# EAGLE design sensor_board_v1.3 (EAGLE 7.7.0)
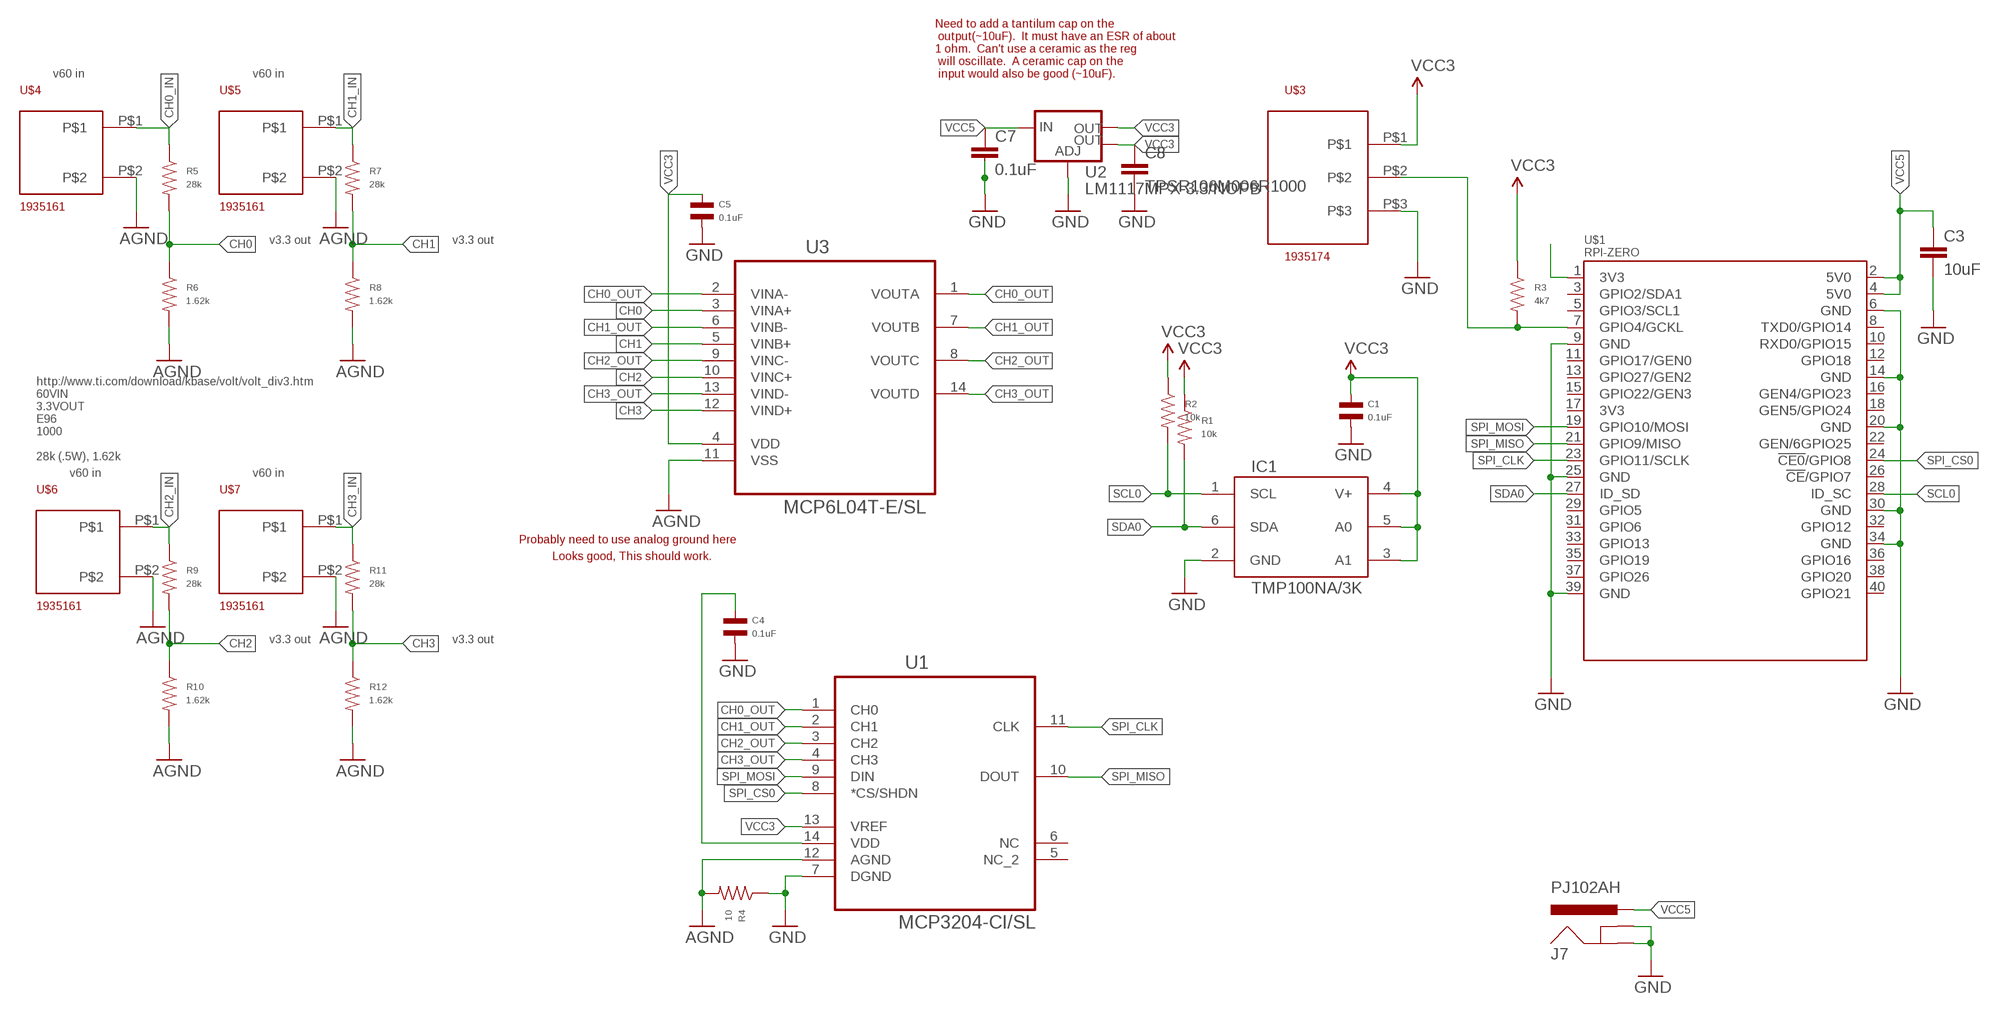
[diagram p0: schematic, sheet 1]

## Parts
C1  0.1uF  CAPACITOR_NP_0603  [C0603]
C3  10uF  CAP0603-CAP  [0603-CAP]
C4  0.1uF  CAPACITOR_NP_0603  [C0603]
C5  0.1uF  CAPACITOR_NP_0603  [C0603]
C7  0.1uF  CAP0603-CAP  [0603-CAP]
C8  TPSR106M006R1000  CAP0805  [0805]
IC1  TMP100NA/3K  TMP100  [TI-DBV]
J7  PJ102AH  POWER_JACK  [PJ-102AH]
R1  10k  RESISTOR_0603  [R0603]
R2  10k  RESISTOR_0603  [R0603]
R3  4k7  RESISTOR_0603  [R0603]
R4  10  RESISTOR_1206  [R1206]
R5  28k  RESISTOR_1206  [R1206]
R6  1.62k  RESISTOR_1206  [R1206]
R7  28k  RESISTOR_1206  [R1206]
R8  1.62k  RESISTOR_1206  [R1206]
R9  28k  RESISTOR_1206  [R1206]
R10  1.62k  RESISTOR_1206  [R1206]
R11  28k  RESISTOR_1206  [R1206]
R12  1.62k  RESISTOR_1206  [R1206]
U1  MCP3204-CI/SL  [SOIC127P600X175-14N]
U2  LM1117MPX-3.3/NOPB  V_REG_LM1117SOT223  [SOT223]
U3  MCP6L04T-E/SL  [SOIC127P600X175-14N]
U$1  RPI-ZERO  [RASPBERRYPI_BASTELSTUBE_V13_RASPI_BOARD_B+_FULL]
U$3  1935174  [1935174]
U$4  1935161  [1935161]
U$5  1935161  [1935161]
U$6  1935161  [1935161]
U$7  1935161  [1935161]

## Nets
1WIRE_D: R3.P$2 U$1.7(GPIO4/GCKL) U$3.P$2
AGND: R4.P$2 R6.P$2 R8.P$2 R10.P$2 R12.P$2 U1.12(AGND) U3.11(VSS) U$4.P$2 U$5.P$2 U$6.P$2 U$7.P$2
CH0: R5.P$2 R6.P$1 U3.3(VINA+)
CH0_IN: R5.P$1 U$4.P$1
CH0_OUT: U1.1(CH0) U3.1(VOUTA) U3.2(VINA-)
CH1: R7.P$2 R8.P$1 U3.5(VINB+)
CH1_IN: R7.P$1 U$5.P$1
CH1_OUT: U1.2(CH1) U3.6(VINB-) U3.7(VOUTB)
CH2: R9.P$2 R10.P$1 U3.10(VINC+)
CH2_IN: R9.P$1 U$6.P$1
CH2_OUT: U1.3(CH2) U3.8(VOUTC) U3.9(VINC-)
CH3: R11.P$2 R12.P$1 U3.12(VIND+)
CH3_IN: R11.P$1 U$7.P$1
CH3_OUT: U1.4(CH3) U3.13(VIND-) U3.14(VOUTD)
GND: C1.P$2 C3.2 C4.P$2 C5.P$2 C7.2 C8.2 IC1.2(GND) J7.2(GND) J7.3(GNDBREAK) R4.P$1 U1.7(DGND) U2.1(ADJ) U$1.6(GND) U$1.9(GND) U$1.14(GND) U$1.20(GND) U$1.25(GND) U$1.30(GND) U$1.34(GND) U$1.39(GND) U$3.P$3
SCL0: IC1.1(SCL) R2.P$2 U$1.28(ID_SC)
SDA0: IC1.6(SDA) R1.P$2 U$1.27(ID_SD)
SPI_CLK: U1.11(CLK) U$1.23(GPIO11/SCLK)
SPI_CS0: U1.8(*CS/SHDN) U$1.24(!CE0!/GPIO8)
SPI_MISO: U1.10(DOUT) U$1.21(GPIO9/MISO)
SPI_MOSI: U1.9(DIN) U$1.19(GPIO10/MOSI)
VCC3: C1.P$1 C4.P$1 C5.P$1 C8.1 IC1.3(A1) IC1.4(V+) IC1.5(A0) R1.P$1 R2.P$1 R3.P$1 U1.13(VREF) U1.14(VDD) U2.2(OUT) U2.4(OUT) U3.4(VDD) U$1.1(3V3) U$3.P$1
VCC5: C3.1 C7.1 J7.1(PWR) U2.3(IN) U$1.2(5V0) U$1.4(5V0)
Unconnected: U1.5(NC_2) U1.6(NC) U$1.3(GPIO2/SDA1) U$1.5(GPIO3/SCL1) U$1.8(TXD0/GPIO14) U$1.10(RXD0/GPIO15) U$1.11(GPIO17/GEN0) U$1.12(GPIO18) U$1.13(GPIO27/GEN2) U$1.15(GPIO22/GEN3) U$1.16(GEN4/GPIO23) U$1.17(3V3) U$1.18(GEN5/GPIO24) U$1.22(GEN/6GPIO25) U$1.26(!CE!/GPIO7) U$1.29(GPIO5) U$1.31(GPIO6) U$1.32(GPIO12) U$1.33(GPIO13) U$1.35(GPIO19) U$1.36(GPIO16) U$1.37(GPIO26) U$1.38(GPIO20) U$1.40(GPIO21)

## Notes on the sheet
- v60 in | v60 in
- Need to add a tantilum cap on the
   output(~10uF).  It must have an ESR of about 
  1 ohm.  Can't use a ceramic as the reg
   will oscillate.  A ceramic cap on the
   input would also be good (~10uF).
- v3.3 out | v3.3 out
- http://www.ti.com/download/kbase/volt/volt_div3.htm
  60VIN
  3.3VOUT
  E96
  1000
  
  28k (.5W), 1.62k
- v60 in | v60 in
- Probably need to use analog ground here
- Looks good, This should work.
- v3.3 out | v3.3 out

## Library data of the parts
C1 C4 C5 = MF_Passives:CAPACITOR_NP: Library: MF_Passives Description: Device for Non-Polarized Capacitors. Manufacture part number (MPN) can be added via Attributes. Check https://factory.macrofab.com/parts for the house parts list.; POPULATE: 1
C3 C7 C8 = General:CAP: Capacitor Standard 0603 ceramic capacitor, and 0.1" leaded capacitor.
IC1 = Dual_SFP:TMP100
J7 = Dual_SFP:POWER_JACK
R1-R4 R6 R8 R10 R12 = MF_Passives:RESISTOR: Library: MF_Passives Description: Device for Resistors. Manufacture part number (MPN), Voltage, Tolerance, and Wattage Rating can be added via Attributes. Check https://factory.macrofab.com/parts for the house parts list.; POPULATE: 1
R5 R7 R9 R11 = MF_Passives:RESISTOR: Library: MF_Passives Description: Device for Resistors. Manufacture part number (MPN), Voltage, Tolerance, and Wattage Rating can be added via Attributes. Check https://factory.macrofab.com/parts for the house parts list.; MPN: RNCP1206FTD28K0; POPULATE: 1
U1 = Microchip_By_element14_Batch_1:MCP3204-CI/SL: IC ADC 12BIT 2.7V 4CH SPI; MPN: MCP3204-CI/SL; OC_FARNELL: 1196795; OC_NEWARK: 26M1276; PACKAGE: 14 - SOIC; SUPPLIER: Microchip
U2 = SparkFun-IC-Power:V_REG_LM1117: Voltage Regulator LM1117 Standard adjustable voltage regulator but in SMD form. Spark Fun Electronics SKU : COM-00595; PROD_ID: LM1117MPX-3.3/NOPB
U3 = Microchip_By_element14_Batch_1:MCP6L04T-E/SL: IC, OP-AMP, 1MHZ, 0.6V/µs; MPN: MCP6L04T-E/SL; OC_FARNELL: 1715883; OC_NEWARK: 06R3493; PACKAGE: SOIC - 14; SUPPLIER: Microchip
U$1 = RPI-Zero:RPI-ZERO
U$3 = WhiteBoxOptical:1935174
U$4-U$7 = WhiteBoxOptical:1935161

## Board
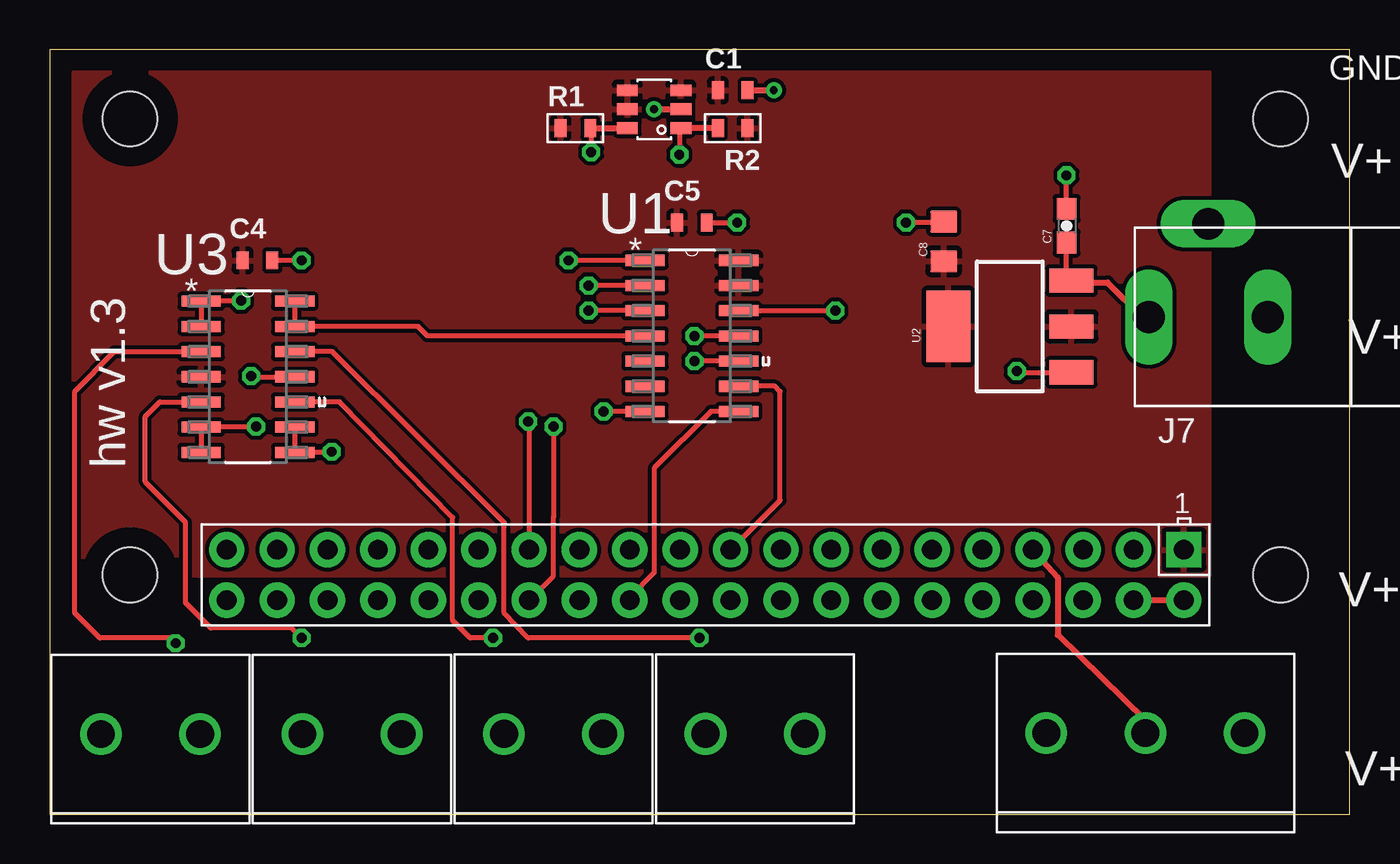
[diagram p1: board, top side]
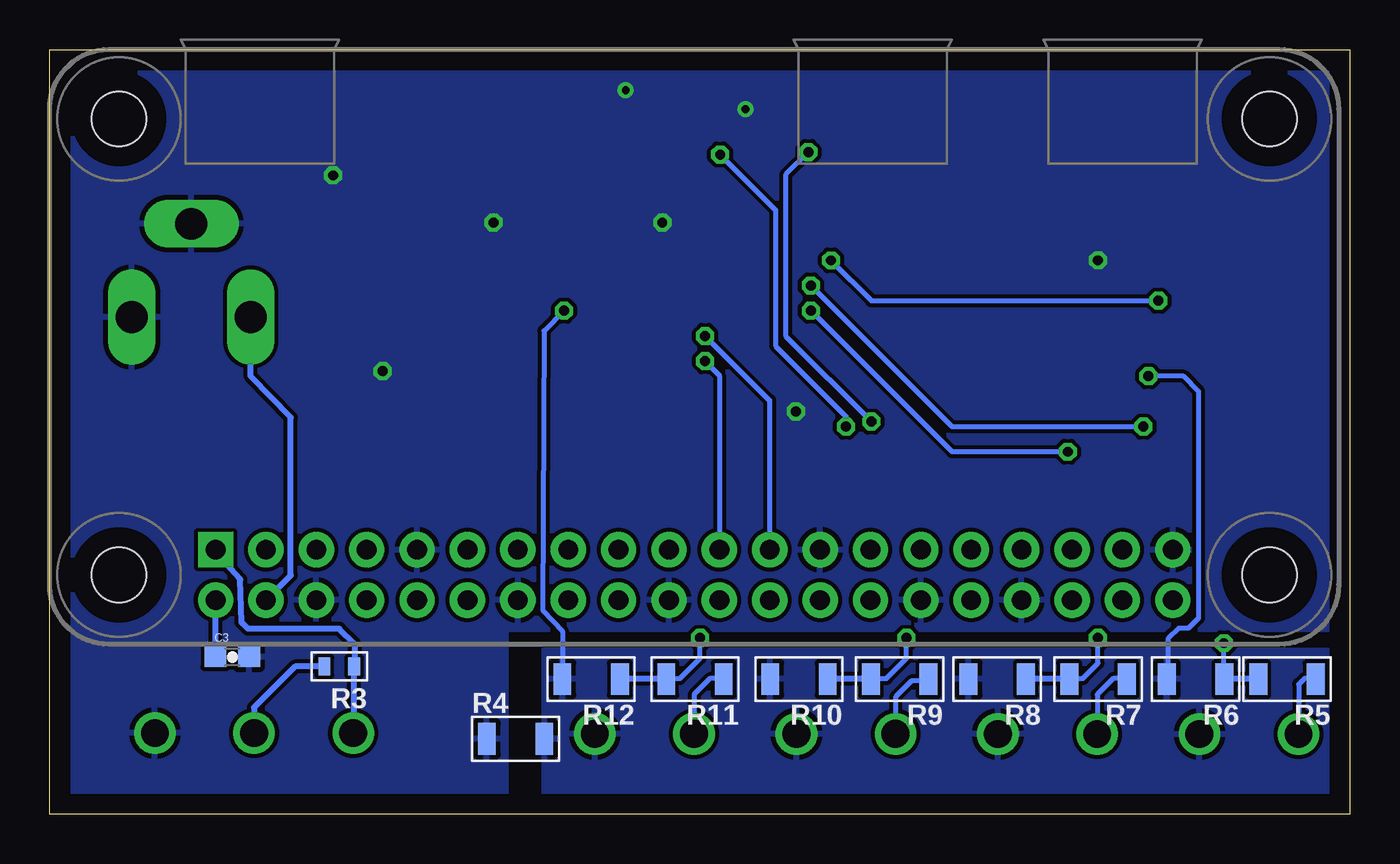
[diagram p2: board, bottom side, seen from below]

Size 65.56 x 38.57 mm. Coordinates in mm from the lower left corner, seen from the top.
Outline: 0,0 65.56,0 65.56,38.57 0,38.57 0,0
Copper layers (1*16): Top 0.035mm / dielectric 1.5mm / Bottom 0.035mm
Design rules "default": minimum track width 10mil, minimum drill 24mil, track to track 8mil, track to pad 8mil, pad to pad 8mil, via to via 8mil, smd to smd 8mil, copper to edge 40mil, drill to drill 8mil, minimum pad ring 10mil, minimum via ring 8mil, stop-mask expansion 4mil, vias tented up to drill 0mil, thermal gap 10mil

### Footprints (pad centres in the part's own frame; a part is rotated, then mirrored left to right if it is on the bottom)
C0603 = smd 0.6 x 0.9: P$1 -0.75,0; P$2 0.75,0
0603-CAP = smd 1 x 1.1: 1 0,0.85; 2 0,-0.85
0805 = smd 1.35 x 1.1: 1 0,1; 2 0,-1
TI-DBV = smd 0.6 x 1.05: 1 -0.95,-1.35; 2 0,-1.35; 3 0.95,-1.35; 4 0.95,1.35; 5 0,1.35; 6 -0.95,1.35
PJ-102AH = drill 1.6 long: 1 0,-3; 2 0,3; 3 -4.7,0
R0603 = smd 0.6 x 0.9: P$1 -0.75,0; P$2 0.75,0
R1206 = smd 0.9 x 1.6: P$1 -1.45,0; P$2 1.45,0
SOIC127P600X175-14N = smd 1.981 x 0.559: 1 -2.362,3.81; 2 -2.362,2.54; 3 -2.362,1.27; 4 -2.362,0; 5 -2.362,-1.27; 6 -2.362,-2.54; 7 -2.362,-3.81; 8 2.362,-3.81; 9 2.362,-2.54; 10 2.362,-1.27; 11 2.362,0; 12 2.362,1.27; 13 2.362,2.54; 14 2.362,3.81
SOT223 = smd 1.219 x 2.235: 1 -2.311,-3.099; 2 0,-3.099; 3 2.311,-3.099 | smd 3.6 x 2.2: 4 0,3.099
RASPBERRYPI_BASTELSTUBE_V13_RASPI_BOARD_B+_FULL = drill 1 pad 1.778 square: 1 8.37,25.23 | drill 1 pad 1.778: 2 8.37,27.77; 3 10.91,25.23; 4 10.91,27.77; 5 13.45,25.23; 6 13.45,27.77; 7 15.99,25.23; 8 15.99,27.77; 9 18.53,25.23; 10 18.53,27.77; 11 21.07,25.23; 12 21.07,27.77; 13 23.61,25.23; 14 23.61,27.77; 15 26.15,25.23; 16 26.15,27.77; 17 28.69,25.23; 18 28.69,27.77; 19 31.23,25.23; 20 31.23,27.77; 21 33.77,25.23; 22 33.77,27.77; 23 36.31,25.23; 24 36.31,27.77; 25 38.85,25.23; 26 38.85,27.77; 27 41.39,25.23; 28 41.39,27.77; 29 43.93,25.23; 30 43.93,27.77; 31 46.47,25.23; 32 46.47,27.77; 33 49.01,25.23; 34 49.01,27.77; 35 51.55,25.23; 36 51.55,27.77; 37 54.09,25.23; 38 54.09,27.77; 39 56.63,25.23; 40 56.63,27.77 | hole 2.75: 3.5,3.5; 3.5,26.5; 61.5,3.5; 61.5,26.5
1935174 = drill 1.4: P$1 -5,0; P$2 0,0; P$3 5,0
1935161 = drill 1.4: P$1 -2.5,0; P$2 2.5,0

### Placement (x,y rotation side)
C1  34.45,36.51 0 top
C3  56.36,7.94 90 bottom
C4  10.48,27.94 0 top
C5  32.38,29.84 0 top
C7  51.28,29.69 180 top
C8  45.09,28.89 180 top
IC1  30.48,35.56 90 top
J7  58.42,25.08 270 top
R1  26.51,34.61 0 top
R2  34.45,34.61 180 top
R3  50.96,7.46 180 bottom
R4  42.07,3.81 0 bottom
R5  3.17,6.83 180 bottom
R6  7.78,6.83 180 bottom
R7  12.7,6.83 180 bottom
R8  17.78,6.83 180 bottom
R9  22.7,6.83 180 bottom
R10  27.78,6.83 180 bottom
R11  33.02,6.83 180 bottom
R12  38.26,6.83 180 bottom
U1  32.38,24.13 0 top
U2  48.42,24.61 90 top
U3  10,22.07 0 top
U$1  65.56,38.58 180 top
U$3  55.25,4.1 0 top
U$4  5.09,4.05 0 top
U$5  15.25,4.05 0 top
U$6  25.41,4.06 0 top
U$7  35.57,4.06 0 top

### Tracks (layer width: path | path; a pad name or v marks a point on that pad's centre or on a via)
1WIRE_D
  Top 0.305: U$1.7 50.83,11.96 50.83,9.05 55.25,4.75 U$3.P$2
  Bottom 0.305: R3.P$2 53.18,7.46 55.25,5.39 U$3.P$2
AGND  (via drill 0.5)
  Top 0.254: U1.12 v39.62,25.4 | v10.16,22.1 10.19,22.07 U3.11
  Bottom 0.254: v39.62,25.4 40.64,24.38 40.7,10.29 39.71,9.23 R12.P$2 | R6.P$2 9.14,6.91 9.14,8.89 8.64,9.4 8.13,9.4 7.62,9.91 7.62,21.34 8.38,22.1 v10.16,22.1
  pour Bottom: 0.16,8.26 40.64,8.26 40.64,-0.16 0.16,-0.16
CH0  (via drill 0.5)
  Top 0.254: v6.35,8.64 6.1,8.89 2.54,8.89 1.27,10.16 1.27,21.34 3.27,23.34 U3.3
  Bottom 0.254: R6.P$1 6.35,6.85 v6.35,8.64
  Bottom 0.305: R5.P$2 R6.P$1
CH0_IN
  Bottom 0.254: R5.P$1 1.82,6.73 1.95,6.86 2.29,6.86 2.59,6.56 U$4.P$1
CH0_OUT  (via drill 0.5)
  Top 0.254: U1.1 v26.16,27.94 | v9.65,25.91 9.62,25.88 U3.1 U3.2
  Bottom 0.254: v26.16,27.94 24.13,25.91 v9.65,25.91
CH1  (via drill 0.5)
  Top 0.254: v12.7,8.89 12.19,9.4 8.13,9.4 6.86,10.67 6.86,14.73 4.83,16.76 4.83,20.07 5.56,20.8 U3.5
  Bottom 0.254: R7.P$2 14.12,6.86 13.46,6.86 12.7,7.62 v12.7,8.89
  Bottom 0.305: R7.P$2 R8.P$1
CH1_IN
  Bottom 0.254: R7.P$1 11.28,6.86 11.94,6.86 12.75,6.05 U$5.P$1
CH1_OUT  (via drill 0.5)
  Top 0.254: U1.2 v27.18,26.67 | U3.7 U3.6 7.67,19.56 v10.41,19.56
  Bottom 0.254: v27.18,26.67 20.07,19.56 v10.41,19.56
CH2  (via drill 0.5)
  Top 0.254: v22.35,8.89 21.21,8.89 20.32,9.78 20.32,14.99 14.64,20.8 U3.10
  Bottom 0.254: R9.P$2 24.12,6.86 23.37,6.86 22.35,7.87 v22.35,8.89
  Bottom 0.305: R9.P$2 R10.P$1
CH2_IN
  Bottom 0.254: R9.P$1 21.35,6.73 22.1,6.73 22.91,5.92 U$6.P$1
CH2_OUT  (via drill 0.5)
  Top 0.254: U1.3 v27.18,25.4 | v14.22,18.29 14.19,18.26 U3.8 U3.9
  Bottom 0.254: v27.18,25.4 20.07,18.29 v14.22,18.29
CH3  (via drill 0.5)
  Top 0.254: v32.77,8.89 24.13,8.89 22.92,10.16 22.92,14.73 14.26,23.34 U3.12
  Bottom 0.254: R11.P$2 34.44,6.86 33.78,6.86 32.77,7.87 v32.77,8.89
  Bottom 0.305: R11.P$2 R12.P$1
CH3_IN
  Bottom 0.254: R11.P$1 31.6,6.86 32.26,6.86 33.07,6.05 U$7.P$1
CH3_OUT
  Top 0.254: U1.4 19.05,24.13 18.57,24.61 U3.13 U3.14
GND  (via drill 0.4, 0.5)
  Top 0.254: U1.7 v27.94,20.32 | v12.7,27.94 C4.P$2 | C5.P$2 v34.67,29.84 | C8.2 45.04,29.84 v43.18,29.84 | C7.2 v51.28,32.23 | v48.77,22.35 48.83,22.3 U2.1
  Top 0.305: v30.48,35.56 IC1.2 | C1.P$2 v36.51,36.51
  pour Bottom: 0.64,37.78 64.93,37.78 64.93,0.64 42.55,0.64 42.55,9.37 0.64,9.37
SCL0  (via drill 0.5)
  Top 0.254: U$1.28 25.4,12.03 25.4,14.73 25.4,14.99 v25.4,19.56 | IC1.1 31.75,34.53 v31.75,33.27
  Top 0.305: R2.P$2 IC1.1
  Bottom 0.254: v31.75,33.27 28.96,30.48 28.96,23.62 25.4,20.07 v25.4,19.56
SDA0  (via drill 0.5)
  Top 0.254: R1.P$2 27.3,34.56 v27.3,33.4 | v24.13,19.81 24.17,19.77 U$1.27
  Top 0.305: R1.P$2 IC1.6
  Bottom 0.254: v27.3,33.4 28.45,32.26 28.45,24.13 v24.13,19.81
SPI_CLK  (via drill 0.5)
  Top 0.254: U1.11 v32.51,24.13
  Bottom 0.254: v32.51,24.13 29.25,20.87 U$1.23
SPI_CS0
  Top 0.254: U1.8 33.34,20.32 30.48,17.46 30.48,12.19 29.25,10.97 U$1.24
SPI_MISO  (via drill 0.5)
  Top 0.254: U1.10 v32.51,22.86
  Bottom 0.254: v32.51,22.86 31.79,22.14 U$1.21
SPI_MOSI
  Top 0.254: U$1.19 36.83,15.84 36.83,21.34 36.58,21.59 U1.9
VCC3
  Bottom 0.305: U$3.P$1 50.21,4.15 R3.P$1 50.16,7.5 50.16,8.57 50.96,9.37 55.56,9.37 55.88,9.68 55.94,11.84 57.19,13.22 U$1.1
  pour Top: 1.27,37.47 58.42,37.47 58.42,12.06 1.27,12.06
VCC5
  Top 0.254: U2.3 51.28,27.16 C7.1
  Top 0.305: U$1.4 U$1.2 | U2.3 51.61,26.83 53.34,26.83 55.09,25.08 J7.1
  Bottom 0.305: U$1.2 57.21,10.79 C3.1 | U$1.4 53.4,12.06 53.4,20 55.42,22.08 J7.1

### Text on the board
tSilk: GND | V+ | V+ | V+ | V+
_tsilk: hw v1.3